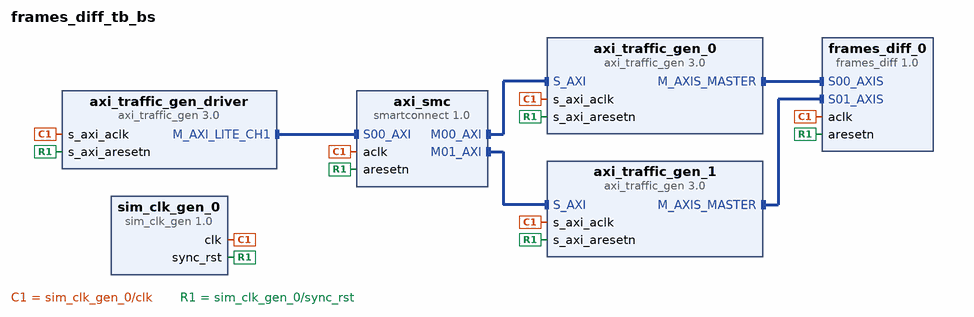
[diagram p0: block diagram of the top level]
# Vivado block design frames_diff_tb_bs, xc7z010clg400-1, Vivado 2021.2
create_bd_design frames_diff_tb_bs

create_bd_cell -type ip -vlnv xilinx.com:ip:axi_traffic_gen:3.0 axi_traffic_gen_0
set_property -dict [list \
  CONFIG.C_ATG_MODE AXI4-Stream \
  CONFIG.C_AXIS_SPARSE_EN false \
  CONFIG.C_AXIS_TDATA_WIDTH 8 \
  CONFIG.C_AXIS_TDEST_WIDTH 0 \
  CONFIG.C_AXIS_TID_WIDTH 0 \
  CONFIG.C_AXIS_TUSER_WIDTH 0 \
  CONFIG.STRM_DATA_SEED 0xABCE \
] [get_bd_cells axi_traffic_gen_0]
create_bd_cell -type ip -vlnv xilinx.com:ip:axi_traffic_gen:3.0 axi_traffic_gen_1
set_property -dict [list \
  CONFIG.C_ATG_MODE AXI4-Stream \
  CONFIG.C_AXIS_SPARSE_EN false \
  CONFIG.C_AXIS_TDATA_WIDTH 8 \
  CONFIG.C_AXIS_TDEST_WIDTH 0 \
  CONFIG.C_AXIS_TID_WIDTH 0 \
  CONFIG.C_AXIS_TUSER_WIDTH 0 \
  CONFIG.STRM_DATA_SEED 0xABCD \
] [get_bd_cells axi_traffic_gen_1]
create_bd_cell -type ip -vlnv xilinx.com:ip:sim_clk_gen:1.0 sim_clk_gen_0
set_property -dict {CONFIG.INITIAL_RESET_CLOCK_CYCLES 20} [get_bd_cells sim_clk_gen_0]
create_bd_cell -type ip -vlnv xilinx.com:ip:axi_traffic_gen:3.0 axi_traffic_gen_driver
set_property -dict [list \
  CONFIG.C_ATG_MIF_DATA_DEPTH 32 \
  CONFIG.C_ATG_MODE AXI4-Lite \
  CONFIG.C_ATG_SYSTEM_CH1_HIGH 0xFFFFFFFF \
  CONFIG.C_ATG_SYSTEM_INIT_ADDR_MIF ../../../../../../edit_frames_diff_v1_0.sim/sim_1/behav/xsim/addr.coe \
  CONFIG.C_ATG_SYSTEM_INIT_DATA_MIF ../../../../../../edit_frames_diff_v1_0.sim/sim_1/behav/xsim/data.coe \
  CONFIG.C_ATG_SYSTEM_MAX_CHANNELS 1 \
  CONFIG.C_ATG_SYSTEM_TEST_MAX_CLKS 50000 \
] [get_bd_cells axi_traffic_gen_driver]
create_bd_cell -type ip -vlnv xilinx.com:ip:smartconnect:1.0 axi_smc
set_property -dict {CONFIG.NUM_MI 2 CONFIG.NUM_SI 1} [get_bd_cells axi_smc]
create_bd_cell -type ip -vlnv xilinx.com:user:frames_diff:1.0 frames_diff_0

# ---- connections ----

connect_bd_intf_net [get_bd_intf_pins axi_smc/M00_AXI] [get_bd_intf_pins axi_traffic_gen_0/S_AXI]
connect_bd_intf_net [get_bd_intf_pins axi_smc/M01_AXI] [get_bd_intf_pins axi_traffic_gen_1/S_AXI]
connect_bd_intf_net [get_bd_intf_pins axi_traffic_gen_0/M_AXIS_MASTER] [get_bd_intf_pins frames_diff_0/S00_AXIS]
connect_bd_intf_net [get_bd_intf_pins axi_traffic_gen_1/M_AXIS_MASTER] [get_bd_intf_pins frames_diff_0/S01_AXIS]
connect_bd_intf_net -intf_net axi_traffic_gen_2_M_AXI_LITE_CH1 [get_bd_intf_pins axi_traffic_gen_driver/M_AXI_LITE_CH1] [get_bd_intf_pins axi_smc/S00_AXI]
connect_bd_net [get_bd_pins sim_clk_gen_0/clk] \
  [get_bd_pins axi_traffic_gen_0/s_axi_aclk] [get_bd_pins axi_traffic_gen_1/s_axi_aclk] [get_bd_pins axi_smc/aclk] \
  [get_bd_pins axi_traffic_gen_driver/s_axi_aclk] [get_bd_pins frames_diff_0/aclk]
connect_bd_net [get_bd_pins sim_clk_gen_0/sync_rst] \
  [get_bd_pins axi_traffic_gen_0/s_axi_aresetn] [get_bd_pins axi_traffic_gen_1/s_axi_aresetn] \
  [get_bd_pins axi_traffic_gen_driver/s_axi_aresetn] [get_bd_pins axi_smc/aresetn] [get_bd_pins frames_diff_0/aresetn]

# ---- address map ----
assign_bd_address -offset 0x00000000 -range 64K -target_address_space [get_bd_addr_spaces axi_traffic_gen_driver/Reg1] [get_bd_addr_segs axi_traffic_gen_0/S_AXI/Reg0]
assign_bd_address -offset 0x00010000 -range 64K -target_address_space [get_bd_addr_spaces axi_traffic_gen_driver/Reg1] [get_bd_addr_segs axi_traffic_gen_1/S_AXI/Reg0]
assign_bd_address -offset 0x44A00000 -range 64K -target_address_space [get_bd_addr_spaces axi_traffic_gen_driver/Reg2] [get_bd_addr_segs axi_traffic_gen_0/S_AXI/Reg0]
assign_bd_address -offset 0x44A10000 -range 64K -target_address_space [get_bd_addr_spaces axi_traffic_gen_driver/Reg2] [get_bd_addr_segs axi_traffic_gen_1/S_AXI/Reg0]

validate_bd_design
save_bd_design
